# Altium schematic sheet PSU_3V3_LD29300.SchDoc: PSU 3V3
size A4; DocumentNumber: 17; SheetNumber: 17; SheetTotal: 18
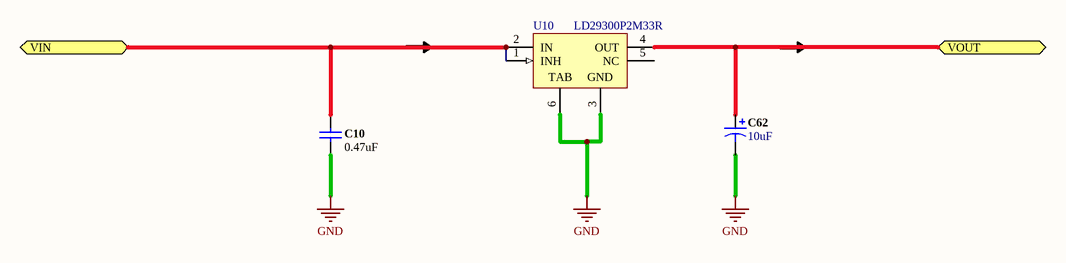
[diagram p0: PSU_3V3_LD29300.SchDoc]

## Parts
C10  0.47uF  [0805C-GENERIC]
C62  10uF  [AVX-CAPC3528_V]
U10  LD29300P2M33R  [P2PAK/A_N]

## Ports
VIN, VOUT

## Nets
GND: C10.2 C62.2 U10.3(GND) U10.6(TAB)
VIN: C10.1 U10.1(INH) U10.2(IN) ; port VIN
VOUT: C62.1 U10.4(OUT) ; port VOUT

Not connected (* = marked no-connect by the designer): U10 5(NC)

## Notes on the sheet
- Title
- Size:
- Date:
- A4
- Number:
- Time:
- Revision:
- Sheet
- of
- File:

## Library data of the parts
C10 = D-101-0027: Capacitor, Ceramic, 10% 10V 0805 X7R; Polarity: Non-Polarized; Capacitance: 0.47uF; Dielectric: X7R; Mounting Technology: Surface Mount; Rated Voltage: 10 V; Status: Production; Technology: Ceramic; Tolerance: 10 %; Category: Capacitor
C62 = CMP-0279-00001-1: Capacitor, Tantalum, 10uF 10% 20V MCCT-B (3528) - TAJB106K020RNJ; Manufacturer: AVX; Polarity: Polarized; PartNumber: TAJB106K020RNJ; PackageDescription: 2-Pin SMT Capacitor, 3.5 x 2.8 mm Body; ComponentLink1URL: http://www.avx.com/; PackageReference: CAPC3528; ComponentLink2Description: Datasheet; Value: 10uF; Technology: Tantalum; ComponentLink2URL: http://www.avx.com/docs/Catalogs/taj.pdf; Tolerance: 10%; ComponentLink1Description: Manufacturer URL; Rated Voltage: 20V; DatasheetVersion: Jun-13; Mounting Technology: Surface Mount
U10 = LD29300P2M33R: 3A, Very Low-Drop Voltage Regulators, 3.3V, 6-Pin P2PAK/A; DatasheetVersion: Jul-2008; PackageVersion: 2008; PackageReference: P2PAK/A; PackageDescription: 6-Pin Transistor Outline Package 1.7 mm Pitch, 15.4 mm Lead Span; PartNumber: LD29300P2M33R; ComponentLink1Description: Manufacturer URL; ComponentLink1URL: http://www.st.com; ComponentLink2Description: Datasheet; ComponentLink2URL: http://www.st.com/internet/com/TECHNICAL_RESOURCES/TECHNICAL_LITERATURE/DATASHEET/CD00003208.pdf